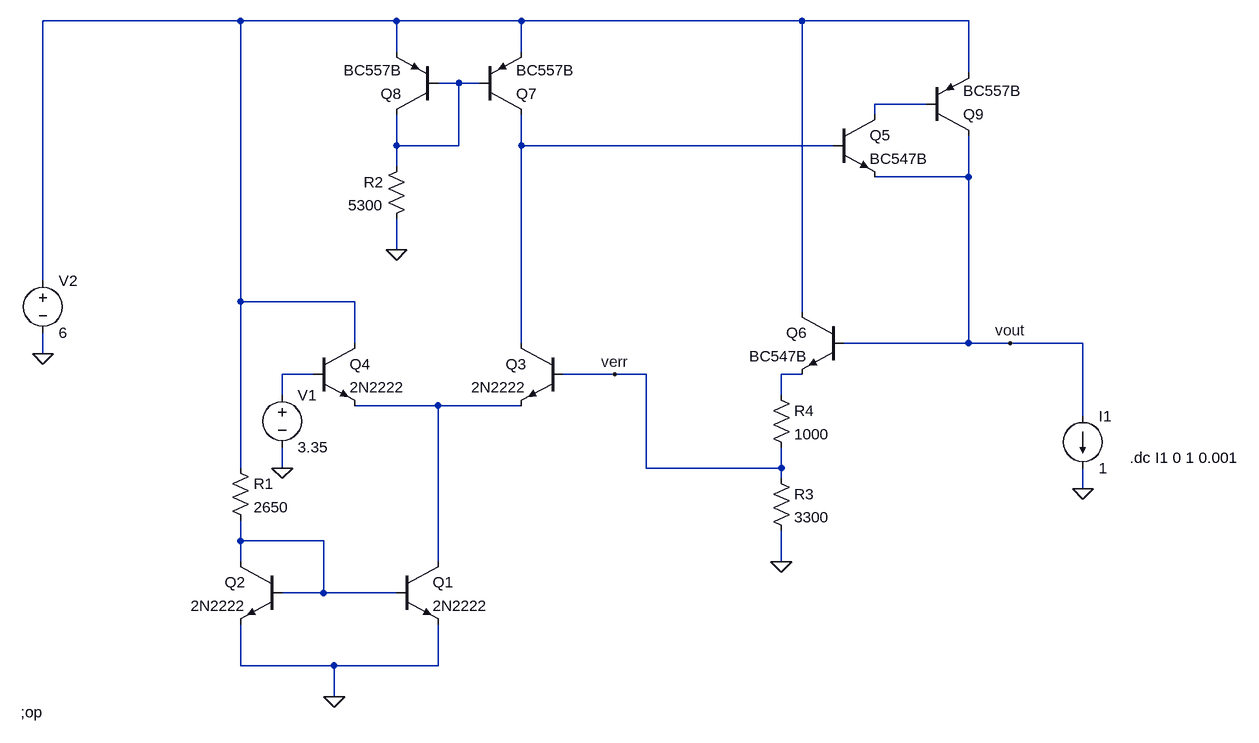
[diagram p0: schematic modelo_1_1.asc]
modelo_1_1.asc, the LTspice schematic file:
Version 4
SHEET 1 1484 680
WIRE -128 -496 -432 -496
WIRE 112 -496 -128 -496
WIRE 304 -496 112 -496
WIRE 736 -496 304 -496
WIRE 992 -496 736 -496
WIRE 112 -448 112 -496
WIRE 304 -448 304 -496
WIRE 992 -416 992 -496
WIRE 208 -400 176 -400
WIRE 240 -400 208 -400
WIRE 928 -368 848 -368
WIRE 848 -352 848 -368
WIRE 112 -304 112 -352
WIRE 208 -304 208 -400
WIRE 208 -304 112 -304
WIRE 304 -304 304 -352
WIRE 784 -304 304 -304
WIRE 112 -272 112 -304
WIRE 992 -256 992 -320
WIRE 992 -256 848 -256
WIRE 112 -144 112 -192
WIRE -432 -96 -432 -496
WIRE -128 -64 -128 -496
WIRE 48 -64 -128 -64
WIRE 736 -48 736 -496
WIRE 48 0 48 -64
WIRE 304 0 304 -304
WIRE 992 0 992 -256
WIRE 992 0 800 0
WIRE 1056 0 992 0
WIRE 1168 0 1056 0
WIRE -432 16 -432 -16
WIRE -16 48 -64 48
WIRE 448 48 368 48
WIRE 496 48 448 48
WIRE 736 48 704 48
WIRE -64 80 -64 48
WIRE 704 80 704 48
WIRE 176 96 48 96
WIRE 304 96 176 96
WIRE 1168 112 1168 0
WIRE -128 192 -128 -64
WIRE -64 192 -64 160
WIRE 496 192 496 48
WIRE 704 192 704 160
WIRE 704 192 496 192
WIRE 704 208 704 192
WIRE 1168 224 1168 192
WIRE -128 304 -128 272
WIRE 0 304 -128 304
WIRE -128 336 -128 304
WIRE 176 336 176 96
WIRE 704 336 704 288
WIRE 0 384 0 304
WIRE 0 384 -64 384
WIRE 112 384 0 384
WIRE -128 496 -128 432
WIRE 16 496 -128 496
WIRE 176 496 176 432
WIRE 176 496 16 496
WIRE 16 544 16 496
FLAG 16 544 0
FLAG -64 192 0
FLAG -432 16 0
FLAG 112 -144 0
FLAG 1056 0 vout
FLAG 448 48 verr
FLAG 1168 224 0
FLAG 704 336 0
SYMBOL npn 112 336 R0
SYMATTR InstName Q1
SYMATTR Value 2N2222
SYMBOL npn -64 336 M0
SYMATTR InstName Q2
SYMATTR Value 2N2222
SYMBOL npn 368 0 M0
SYMATTR InstName Q3
SYMATTR Value 2N2222
SYMBOL npn -16 0 R0
SYMATTR InstName Q4
SYMATTR Value 2N2222
SYMBOL npn 784 -352 R0
SYMATTR InstName Q5
SYMATTR Value BC547B
SYMBOL pnp 240 -352 M180
SYMATTR InstName Q7
SYMATTR Value BC557B
SYMBOL pnp 176 -352 R180
SYMATTR InstName Q8
SYMATTR Value BC557B
SYMBOL res -144 176 R0
SYMATTR InstName R1
SYMATTR Value 2650
SYMBOL res 128 -288 M0
SYMATTR InstName R2
SYMATTR Value 5300
SYMBOL pnp 928 -320 M180
SYMATTR InstName Q9
SYMATTR Value BC557B
SYMBOL voltage -64 64 R0
WINDOW 123 0 0 Left 0
WINDOW 39 0 0 Left 0
SYMATTR InstName V1
SYMATTR Value 3.35
SYMBOL voltage -432 -112 R0
WINDOW 123 0 0 Left 0
WINDOW 39 0 0 Left 0
SYMATTR InstName V2
SYMATTR Value 6
SYMBOL npn 800 -48 M0
SYMATTR InstName Q6
SYMATTR Value BC547B
SYMBOL res 688 64 R0
SYMATTR InstName R4
SYMATTR Value 1000
SYMBOL current 1168 112 R0
WINDOW 123 0 0 Left 0
WINDOW 39 0 0 Left 0
SYMATTR InstName I1
SYMATTR Value 1
SYMBOL res 688 192 R0
SYMATTR InstName R3
SYMATTR Value 3300
TEXT -466 568 Left 2 !;op
TEXT 1240 176 Left 2 !.dc I1 0 1 0.001

The netlist it stands for:
* modelo_1_1.asc
Q1 N007 N008 0 0 2N2222
Q2 N008 N008 0 0 2N2222
Q3 N004 verr N007 0 2N2222
Q4 N001 N005 N007 0 2N2222
Q5 N003 N004 vout 0 BC547B
Q7 N004 N002 N001 0 BC557B
Q8 N002 N002 N001 0 BC557B
R1 N001 N008 2650
R2 N002 0 5300
Q9 vout N003 N001 0 BC557B
V1 N005 0 3.35
V2 N001 0 6
Q6 N001 vout N006 0 BC547B
R4 N006 verr 1000
I1 vout 0 1
R3 verr 0 3300
.model NPN NPN
.model PNP PNP
.lib standard.bjt
;op
.dc I1 0 1 0.001
.backanno
.end